# Altium project Hardware2_Smartwatch.PrjPcb (part 2 of 3)

## Sheet 6_Airframe-NXP_i.MX7.SchDoc
size A2; SheetNumber: 6; SheetTotal: 9
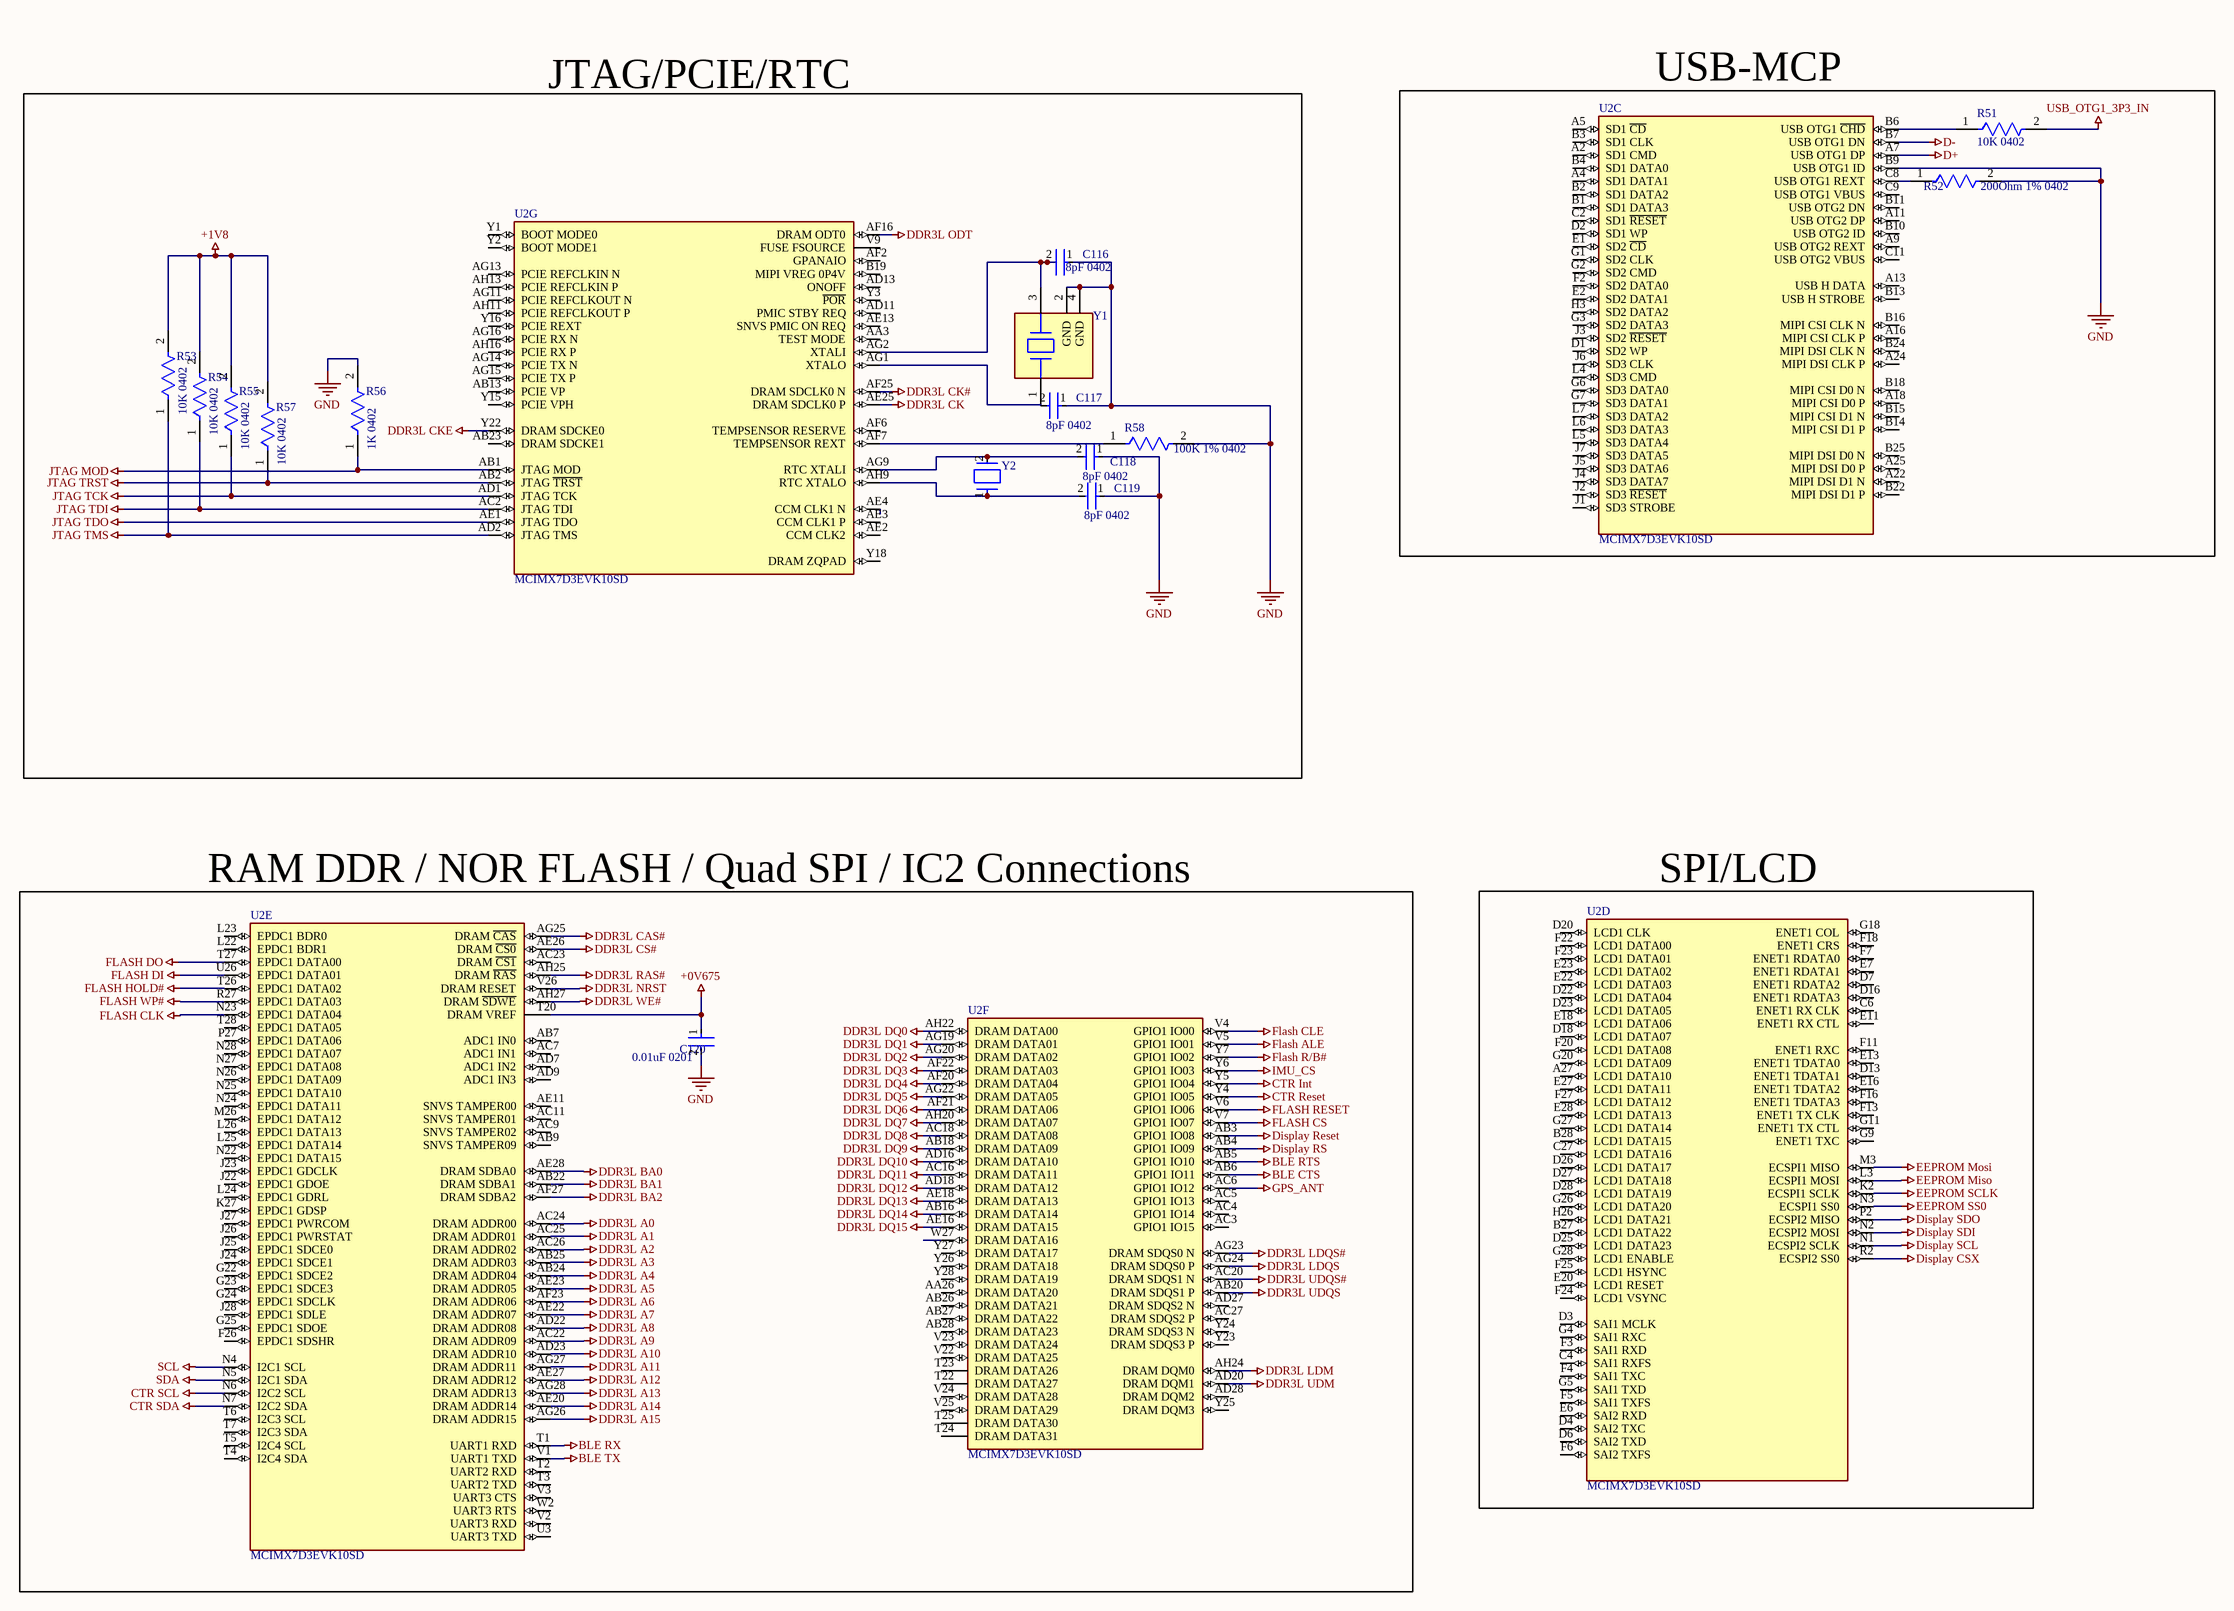
[diagram p6: 6_Airframe-NXP_i.MX7.SchDoc]

### Parts
C116  8pF 0402  [FP-C0402C225M9PACTU-MFG]
C117  8pF 0402  [FP-C0402C225M9PACTU-MFG]
C118  8pF 0402  [FP-C0402C225M9PACTU-MFG]
C119  8pF 0402  [FP-C0402C225M9PACTU-MFG]
C120  0.01uF 0201  [FP-C0603-030-0_03-IPC_C]
R51  10K 0402  [FP-CRCW0402-e3-IPC_B]
R52  200Ohm 1% 0402  [FP-CRCW0402-e3-IPC_C]
R53  10K 0402  [FP-CRCW0402-e3-IPC_B]
R54  10K 0402  [FP-CRCW0402-e3-IPC_B]
R55  10K 0402  [FP-CRCW0402-e3-IPC_B]
R56  1K 0402  [FP-CRCW0402-e3-IPC_B]
R57  10K 0402  [FP-CRCW0402-e3-IPC_B]
R58  100K 1% 0402  [FP-CRCW0402-e3-IPC_C]
U2  MCIMX7D3EVK10SD  [FP-SOT1839-1-IPC_C]  (parts C,D,E,F,G of 9)
Y1  ABM8AIG-24.000MHZ-12-2Z-T3  [FP-ABM8AIG-MFG]  (value not drawn)
Y2  ABS06-32.768KHZ-9-T  [FP-ABS06-MFG]  (value not drawn)

### Nets
+0V675: C120.1 U2.T20(DRAM_VREF)
+1V8: R53.2 R54.2 R55.2 R57.2
BLE CTS: U2.AB6(GPIO1_IO11)
BLE RTS: U2.AB5(GPIO1_IO10)
BLE RX: U2.T1(UART1_RXD)
BLE TX: U2.V1(UART1_TXD)
CTR Int: U2.Y5(GPIO1_IO04)
CTR Reset: U2.Y4(GPIO1_IO05)
CTR SCL: U2.N6(I2C2_SCL)
CTR SDA: U2.N7(I2C2_SDA)
D+: U2.A7(USB_OTG1_DP)
D-: U2.B7(USB_OTG1_DN)
DDR3L A0: U2.AC24(DRAM_ADDR00)
DDR3L A1: U2.AC25(DRAM_ADDR01)
DDR3L A2: U2.AC26(DRAM_ADDR02)
DDR3L A3: U2.AB25(DRAM_ADDR03)
DDR3L A4: U2.AB24(DRAM_ADDR04)
DDR3L A5: U2.AE23(DRAM_ADDR05)
DDR3L A6: U2.AF23(DRAM_ADDR06)
DDR3L A7: U2.AE22(DRAM_ADDR07)
DDR3L A8: U2.AD22(DRAM_ADDR08)
DDR3L A9: U2.AC22(DRAM_ADDR09)
DDR3L A10: U2.AD23(DRAM_ADDR10)
DDR3L A11: U2.AG27(DRAM_ADDR11)
DDR3L A12: U2.AE27(DRAM_ADDR12)
DDR3L A13: U2.AG28(DRAM_ADDR13)
DDR3L A14: U2.AE20(DRAM_ADDR14)
DDR3L A15: U2.AG26(DRAM_ADDR15)
DDR3L BA0: U2.AE28(DRAM_SDBA0)
DDR3L BA1: U2.AB22(DRAM_SDBA1)
DDR3L BA2: U2.AF27(DRAM_SDBA2)
DDR3L CAS#: U2.AG25(DRAM_~{CAS})
DDR3L CK: U2.AE25(DRAM_SDCLK0_P)
DDR3L CK#: U2.AF25(DRAM_SDCLK0_N)
DDR3L CKE: U2.Y22(DRAM_SDCKE0)
DDR3L CS#: U2.AE26(DRAM_~{CS0})
DDR3L DQ0: U2.AH22(DRAM_DATA00)
DDR3L DQ1: U2.AG19(DRAM_DATA01)
DDR3L DQ2: U2.AG20(DRAM_DATA02)
DDR3L DQ3: U2.AF22(DRAM_DATA03)
DDR3L DQ4: U2.AF20(DRAM_DATA04)
DDR3L DQ5: U2.AG22(DRAM_DATA05)
DDR3L DQ6: U2.AF21(DRAM_DATA06)
DDR3L DQ7: U2.AH20(DRAM_DATA07)
DDR3L DQ8: U2.AC18(DRAM_DATA08)
DDR3L DQ9: U2.AB18(DRAM_DATA09)
DDR3L DQ10: U2.AD16(DRAM_DATA10)
DDR3L DQ11: U2.AC16(DRAM_DATA11)
DDR3L DQ12: U2.AD18(DRAM_DATA12)
DDR3L DQ13: U2.AE18(DRAM_DATA13)
DDR3L DQ14: U2.AB16(DRAM_DATA14)
DDR3L DQ15: U2.AE16(DRAM_DATA15)
DDR3L LDM: U2.AH24(DRAM_DQM0)
DDR3L LDQS: U2.AG24(DRAM_SDQS0_P)
DDR3L LDQS#: U2.AG23(DRAM_SDQS0_N)
DDR3L NRST: U2.V26(DRAM_RESET)
DDR3L ODT: U2.AF16(DRAM_ODT0)
DDR3L RAS#: U2.AH25(DRAM_~{RAS})
DDR3L UDM: U2.AD20(DRAM_DQM1)
DDR3L UDQS: U2.AB20(DRAM_SDQS1_P)
DDR3L UDQS#: U2.AC20(DRAM_SDQS1_N)
DDR3L WE#: U2.AH27(DRAM_~{SDWE})
Display CSX: U2.R2(ECSPI2_SS0)
Display Reset: U2.AB3(GPIO1_IO08)
Display RS: U2.AB4(GPIO1_IO09)
Display SCL: U2.N1(ECSPI2_SCLK)
Display SDI: U2.N2(ECSPI2_MOSI)
Display SDO: U2.P2(ECSPI2_MISO)
EEPROM Miso: U2.L3(ECSPI1_MOSI)
EEPROM Mosi: U2.M3(ECSPI1_MISO)
EEPROM SCLK: U2.K2(ECSPI1_SCLK)
EEPROM SS0: U2.N3(ECSPI1_SS0)
Flash ALE: U2.V5(GPIO1_IO01)
Flash CLE: U2.V4(GPIO1_IO00)
FLASH CLK: U2.N23(EPDC1_DATA04)
FLASH CS: U2.V7(GPIO1_IO07)
FLASH DI: U2.U26(EPDC1_DATA01)
FLASH DO: U2.T27(EPDC1_DATA00)
FLASH HOLD#: U2.T26(EPDC1_DATA02)
Flash R/B#: U2.Y7(GPIO1_IO02)
FLASH RESET: U2.V6(GPIO1_IO06)
FLASH WP#: U2.R27(EPDC1_DATA03)
GND: C116.1 C117.1 C118.1 C119.1 C120.2 R52.2 R56.2 R58.2 U2.B9(USB_OTG1_ID) Y1.2(GND) Y1.4(GND)  [project net CTR]
GPS_ANT: U2.AC6(GPIO1_IO12)
IMU_CS: U2.Y6(GPIO1_IO03)
JTAG MOD: R56.1 U2.AB1(JTAG_MOD)
JTAG TCK: R55.1 U2.AD1(JTAG_TCK)
JTAG TDI: R54.1 U2.AC2(JTAG_TDI)
JTAG TDO: U2.AE1(JTAG_TDO)
JTAG TMS: R53.1 U2.AD2(JTAG_TMS)
JTAG TRST: R57.1 U2.AB2(JTAG_~{TRST})
SCL: U2.N4(I2C1_SCL)
SDA: U2.N5(I2C1_SDA)
USB_OTG1_3P3_IN: R51.2  [project net +VS]
NetC116_2: C116.2 U2.AG2(XTALI) Y1.3
NetC118_2: C118.2 U2.AG9(RTC_XTALI) Y2.2
NetC119_2: C119.2 U2.AH9(RTC_XTALO) Y2.1
NetR51_1: R51.1 U2.B6(USB_OTG1_~{CHD})
NetR52_1: R52.1 U2.C8(USB_OTG1_REXT)
NetR58_1: R58.1 U2.AF7(TEMPSENSOR_REXT)
NetU2_AG1: U2.AG1(XTALO) Y1.1

Not connected (* = marked no-connect by the designer): C117 2; U2 A2(SD1_CMD) A4(SD1_DATA1) A5(SD1_~{CD}) A9(USB_OTG2_REXT) A11(USB_OTG2_DP) A13(USB_H_DATA) A16(MIPI_CSI_CLK_P) A18(MIPI_CSI_D0_P) A22(MIPI_DSI_D1_N) A24(MIPI_DSI_CLK_P) A25(MIPI_DSI_D0_P) A27(LCD1_DATA10) AA3(TEST_MODE) AA26(DRAM_DATA20) AB7(ADC1_IN0) AB9(SNVS_TAMPER09) AB13(PCIE_VP) AB23(DRAM_SDCKE1) AB26(DRAM_DATA21) AB27(DRAM_DATA22) AB28(DRAM_DATA23) AC3(GPIO1_IO15) AC4(GPIO1_IO14) AC5(GPIO1_IO13) AC7(ADC1_IN1) AC9(SNVS_TAMPER02) AC11(SNVS_TAMPER01) AC23(DRAM_~{CS1}) AC27(DRAM_SDQS2_P) AD7(ADC1_IN2) AD9(ADC1_IN3) AD11(PMIC_STBY_REQ) AD13(ONOFF) AD27(DRAM_SDQS2_N) AD28(DRAM_DQM2) AE2(CCM_CLK2) AE3(CCM_CLK1_P) AE4(CCM_CLK1_N) AE11(SNVS_TAMPER00) AE13(SNVS_PMIC_ON_REQ) AF2(GPANAIO) AF6(TEMPSENSOR_RESERVE) AG11(PCIE_REFCLKOUT_N) AG13(PCIE_REFCLKIN_N) AG14(PCIE_TX_N) AG15(PCIE_TX_P) AG16(PCIE_RX_N) AH11(PCIE_REFCLKOUT_P) AH13(PCIE_REFCLKIN_P) AH16(PCIE_RX_P) B1(SD1_DATA3) B2(SD1_DATA2) B3(SD1_CLK) B4(SD1_DATA0) B10(USB_OTG2_ID) B11(USB_OTG2_DN) B13(USB_H_STROBE) B14(MIPI_CSI_D1_P) B15(MIPI_CSI_D1_N) B16(MIPI_CSI_CLK_N) B18(MIPI_CSI_D0_N) B19(MIPI_VREG_0P4V) B22(MIPI_DSI_D1_P) B24(MIPI_DSI_CLK_N) B25(MIPI_DSI_D0_N) B27(LCD1_DATA22) B28(LCD1_DATA15) C2(SD1_~{RESET}) C4(SAI1_RXFS) C6(ENET1_RX_CLK) C9(USB_OTG1_VBUS) C11(USB_OTG2_VBUS) C27(LCD1_DATA16) D1(SD2_WP) D2(SD1_WP) D3(SAI1_MCLK) D4(SAI2_TXC) D6(SAI2_TXD) D7(ENET1_RDATA2) D13(ENET1_TDATA1) D16(ENET1_RDATA3) D18(LCD1_DATA07) D20(LCD1_CLK) D22(LCD1_DATA04) D23(LCD1_DATA05) D25(LCD1_DATA23) D26(LCD1_DATA17) D27(LCD1_DATA18) D28(LCD1_DATA19) E1(SD2_~{CD}) E2(SD2_DATA1) E6(SAI2_RXD) E7(ENET1_RDATA1) E11(ENET1_RX_CTL) E13(ENET1_TDATA0) E16(ENET1_TDATA2) E18(LCD1_DATA06) E20(LCD1_RESET) E22(LCD1_DATA03) E23(LCD1_DATA02) E27(LCD1_DATA11) E28(LCD1_DATA13) F2(SD2_DATA0) F3(SAI1_RXD) F4(SAI1_TXC) F5(SAI1_TXFS) F6(SAI2_TXFS) F7(ENET1_RDATA0) F11(ENET1_RXC) F13(ENET1_TX_CLK) F16(ENET1_TDATA3) F18(ENET1_CRS) F20(LCD1_DATA08) F22(LCD1_DATA00) F23(LCD1_DATA01) F24(LCD1_VSYNC) F25(LCD1_HSYNC) F26(EPDC1_SDSHR) F27(LCD1_DATA12) G1(SD2_CLK) G2(SD2_CMD) G3(SD2_DATA3) G4(SAI1_RXC) G5(SAI1_TXD) G6(SD3_DATA0) G7(SD3_DATA1) G9(ENET1_TXC) G11(ENET1_TX_CTL) G18(ENET1_COL) G20(LCD1_DATA09) G22(EPDC1_SDCE2) G23(EPDC1_SDCE3) G24(EPDC1_SDCLK) G25(EPDC1_SDOE) G26(LCD1_DATA20) G27(LCD1_DATA14) G28(LCD1_ENABLE) H3(SD2_DATA2) H26(LCD1_DATA21) J1(SD3_STROBE) J2(SD3_~{RESET}) J3(SD2_~{RESET}) J4(SD3_DATA7) J5(SD3_DATA6) J6(SD3_CLK) J7(SD3_DATA5) J22(EPDC1_GDOE) J23(EPDC1_GDCLK) J24(EPDC1_SDCE1) J25(EPDC1_SDCE0) J26(EPDC1_PWRSTAT) J27(EPDC1_PWRCOM) J28(EPDC1_SDLE) K27(EPDC1_GDSP) L4(SD3_CMD) L5(SD3_DATA4) L6(SD3_DATA3) L7(SD3_DATA2) L22(EPDC1_BDR1) L23(EPDC1_BDR0) L24(EPDC1_GDRL) L25(EPDC1_DATA14) L26(EPDC1_DATA13) M26(EPDC1_DATA12) N22(EPDC1_DATA15) N24(EPDC1_DATA11) N25(EPDC1_DATA10) N26(EPDC1_DATA09) N27(EPDC1_DATA08) N28(EPDC1_DATA07) P27(EPDC1_DATA06) T2(UART2_RXD) T3(UART2_TXD) T4(I2C4_SDA) T5(I2C4_SCL) T6(I2C3_SCL) T7(I2C3_SDA) T22(DRAM_DATA27) T23(DRAM_DATA26) T24(DRAM_DATA31) T25(DRAM_DATA30) T28(EPDC1_DATA05) U3(UART3_TXD) V2(UART3_RXD) V3(UART3_CTS) V9(FUSE_FSOURCE) V22(DRAM_DATA25) V23(DRAM_DATA24) V24(DRAM_DATA28) V25(DRAM_DATA29) W2(UART3_RTS) W27(DRAM_DATA16) Y1(BOOT_MODE0) Y2(BOOT_MODE1) Y3(~{POR}) Y15(PCIE_VPH) Y16(PCIE_REXT) Y18(DRAM_ZQPAD) Y23(DRAM_SDQS3_P) Y24(DRAM_SDQS3_N) Y25(DRAM_DQM3) Y26(DRAM_DATA18) Y27(DRAM_DATA17) Y28(DRAM_DATA19)

### Notes on the sheet
- JTAG/PCIE/RTC
- (near U2) USB-MCP
- (near U2) RAM DDR / NOR FLASH / Quad SPI / IC2 Connections
- (near U2) SPI/LCD

### Library data of the parts
C116-C119 = CMP-2008-02064-3: CAP CER 2.2UF 6.3V X5R 0402; Tolerance: 20%; Dissipation Factor: 5%; Dielectric Material: Ceramic; Lead Free: Lead Free; Depth: 0.5mm; Series: C; Termination: SMD/SMT; Case Code (Metric): 1005; Case/Package: 0402; Dielectric: X5R; RoHS Compliant: Yes; Thickness: 0.022inch; Voltage Rating: 6.3V; Voltage: 6.3V; Height: 0.5mm; Mount: Surface Mount; Construction: Flat; Case Code (Imperial): 0402; Min Operating Temperature: -55°C; Contact Plating: Tin; Radiation Hardening: No; Number of Pins: 2; Voltage Rating (DC): 6.3V; Capacitance: 2.2uF; Width: 0.5mm; Package Quantity: 1; Packaging: Tape and Reel; Max Operating Temperature: 85°C; Length: 1mm; REACH SVHC: No SVHC
C120 = CMP-08246-007095-1: Multilayer Ceramic Capacitors 220nF ±10% 6.3V X6S SMD 0201; Dielectric: X6S; Resistor Type: Ceramic; Length: 0.6mm; Capacitance: 220nF; Case Code (Metric): 0603; Series: C; Width: 0.012inch; Height: 0.3mm; Voltage Rating: 6.3V; Max Operating Temperature: 105°C; REACH SVHC: No SVHC; RoHS Compliant: Yes; Tolerance: 10%; Termination: SMD/SMT; Case/Package: 0201; Case Code (Imperial): 0201; Weight: 6E-06oz; Lead Free: Lead Free; Construction: Flat; Thickness: 300um; Mount: Surface Mount; Dielectric Material: Ceramic; Voltage Rating (DC): 6.3V; Packaging: Cut Tape; Package Quantity: 1; Min Operating Temperature: -55°C; Depth: 0.3mm
R51 R53-R57 = CMP-2002-08135-2: RES SMD 10K OHM 1% 1/16W 0402; Power Rating: 63mW; Resistance: 10kR; Voltage Rating: 50V; Temperature Coefficient: 100ppm/°C; Case Code (Metric): 1005; Features: Automotive AEC-Q200; Termination: SMD/SMT; Mount: Surface Mount; Package Quantity: 10; Packaging: Tape and Reel; Case Code (Imperial): 0402; Weight: 2.3E-05oz; Lead Free: Lead Free; Width: 0.02inch; Max Power Dissipation: 63mW; Tolerance: 1%; Number of Terminations: 2; Height: 0.35mm; Number of Pins: 2; Composition: Thick Film; Length: 1mm; Voltage Rating (DC): 50V; Case/Package: 0402; Radiation Hardening: No; Contact Plating: Tin; Depth: 0.5mm; Military Standard: Not; Min Operating Temperature: -55°C; Max Operating Temperature: 155°C
R52 R58 = CMP-1011-00429-3: RES Thick Film, 200Ω, 1%, 0.063W, 100ppm/°C, 0402; Max Power Dissipation: 63mW; Voltage Rating: 50V; Resistance: 200R; Termination: SMD/SMT; Weight: 2.3E-05oz; Case/Package: 0402; Contact Plating: Tin; Number of Pins: 2; Width: 0.5mm; Height: 0.35mm; Case Code (Metric): 1005; Military Standard: Not; Features: Automotive AEC-Q200; Power Rating: 63mW; Temperature Coefficient: 100ppm/°C; Tolerance: 1%; Lead Free: Lead Free; Depth: 0.5mm; Max Operating Temperature: 155°C; Min Operating Temperature: -55°C; Package Quantity: 10; Voltage Rating (DC): 50V; Composition: Thick Film; Mount: Surface Mount; Radiation Hardening: No; Length: 1mm; Packaging: Tape and Reel; Number of Terminations: 2; Case Code (Imperial): 0402
U2 = CMP-10096-000008-1: I.MX 7DUAL: REV 1.3; Manufacturer: NXP; Number Of I2C Channels: 4; Number Of Timers/Counters: 11; Nominal Supply Current: 1-1000mA; Max Junction Temp: +105°C; Number Of Uart Channels: 7; Number Of Cores: 2; Interface: I2C,SPI,UART,USB,Ethernet,I2S,LVDS,PCIe,Other; Ram Size: 256KBytes; Data Bus Width: 32bits; Number Of Usb Channels: 3; Number Of Adc Channels: 1; Standoff Height: 0.13mm; Frequency: 1GHz; Max Supply Voltage: 3.6V; Core Architecture: Arm Cortex-A7; Number Of Spi Channels: 5; Memory Type: FLASH,NAND,DDR2,DDR3,OTHER; Min Supply Voltage: 0.95V; ComponentLink2URL: https://www.nxp.com/docs/en/data-sheet/IMX7DCEC.pdf; Number Of Pwm Channels: 4; Package: SOT1839-1; Temperature: -20°C to +105°C; Footprint Url: https://www.nxp.com/docs/en/package-information/98ASA00727D.pdf; RoHS: TRUE; Temperature Range Low: -20°C; Lead Free: Yes; Category: IC; Ipc Land Pattern Name: BGA784N40P28X28_1200X1200X110; Device Class L3: Microprocessors; Mouser Description: i.MX 7Dual: 2x Cortex A7, 2x USB 2.0 OTG with PHY, PCIe, 2xSDIO/MMC, 2x Ethernet, Security; ComponentLink2Description: Datasheet; Manufacturer Part Number: MCIMX7D3EVK10SD; Octopart: https://octopart.com/mcimx7d3evk10sd-nxp+semiconductors-84356608; Digikey Description: I.MX 7DUAL: REV 1.3; Device Class L1: Integrated Circuits (ICs); Temperature Range High: +105°C; Height: 1.1mm; Automotive: No; Number Of Ethernet Channels: 2; Number Of A/D Converters: 1; Device Class L2: Embedded Processors and Controllers
Y1 = CMP-27762-015716-1: Crystal 24MHz ±20ppm (Tol) ±50ppm (Stability) 12pF FUND 50Ω Automotive 4-Pin Ultra Mini-CSMD T/R; ESR (Equivalent Series Resistance): 50R; Series: ABM8AIG; RoHS Compliant: Yes; Load Capacitance: 12pF; Height: 0.031inch; Min Operating Temperature: -40°C; Mount: Surface Mount; Packaging: Cut Tape; Ratings: AEC-Q200; Case/Package: SMD/SMT; Frequency Stability: 50ppm; Max Operating Temperature: 125°C; Length: 0.126inch; Frequency: 24MHz; Frequency Tolerance: 20ppm; Width: 0.098inch
Y2 = CMP-27762-015421-1: Crystal 32.768kHz ±20ppm (Tol) 9pF FUND 90kΩ 2-Pin Mini-CSMD T/R; ESR (Equivalent Series Resistance): 90kR; Max Operating Temperature: 85°C; Frequency Tolerance: 20ppm; Case/Package: CSMD; Termination: SMD/SMT; RoHS Compliant: Yes; Height: 0.6mm; Load Capacitance: 9pF; Packaging: Tape and Reel; Depth: 1.2mm; Tolerance: 20ppm; Frequency: 32.768kHz; Series: ABS06; Width: 1.2mm; Length: 2mm; Number of Pins: 2; Min Operating Temperature: -40°C; Mount: Surface Mount; Lead Free: Lead Free; Package Quantity: 3000

## Sheet 7_Airframe-Sensors.SchDoc
size A4; SheetNumber: 7; SheetTotal: 9
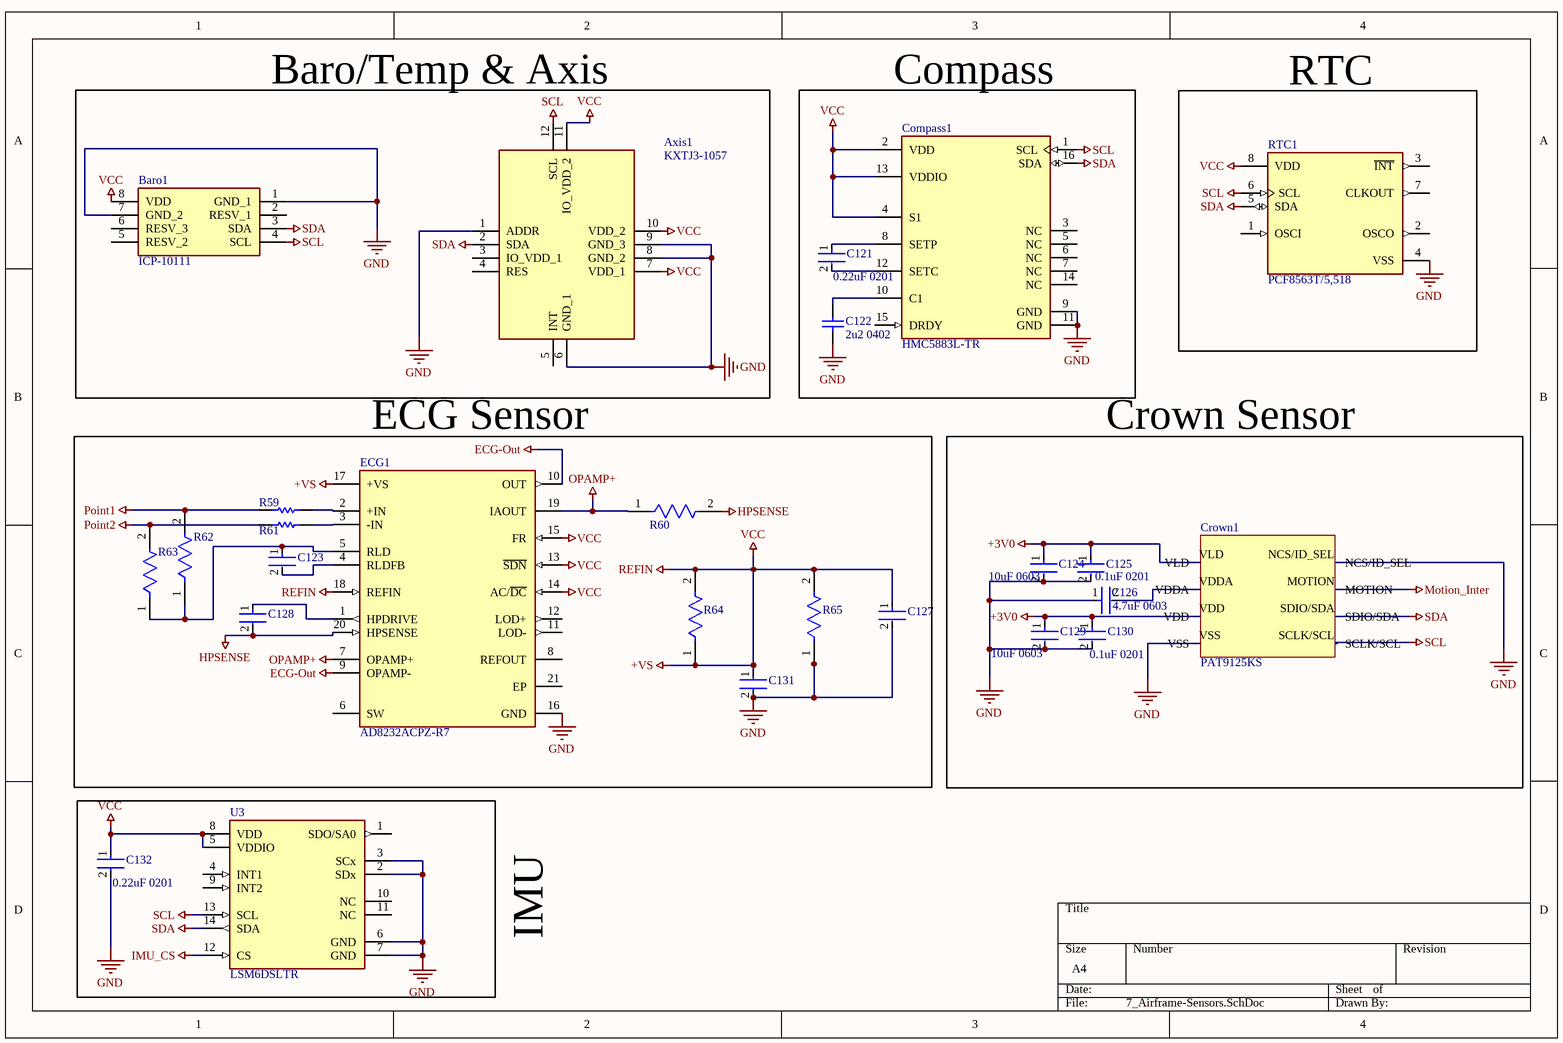
[diagram p7: 7_Airframe-Sensors.SchDoc]

### Parts
Axis1  KXTJ3-1057  [2X2X0.9MMLGA]
Baro1  ICP-10111  [ICP10111]
C121  0.22uF 0201  [FP-C0603-030-0_03-IPC_C]
C122  2u2 0402  [CAPC1005X55X25ML5T10]
C123  GRM1555C1H102JA01D  [FP-GRM155-0_05-IPC_B]  (value not drawn)
C124  10uF 0603  [FP-GRM188-0_2-IPC_C]
C125  0.1uF 0201  [FP-C0603-030-0_03-IPC_C]
C126  4.7uF 0603  [FP-GRM188-0_2-IPC_C]
C127  C0402C104K8PACTU  [FP-C0402-BB-MFG]  (value not drawn)
C128  GRM155R71C224KA12D  [FP-GRM155-0_05-IPC_C]  (value not drawn)
C129  10uF 0603  [FP-GRM188-0_2-IPC_C]
C130  0.1uF 0201  [FP-C0603-030-0_03-IPC_C]
C131  C0402C104K8PACTU  [FP-C0402-BB-MFG]  (value not drawn)
C132  0.22uF 0201  [FP-C0603-030-0_03-IPC_C]
Compass1  HMC5883L-TR  [FP-HMC5883L-TR-MFG]
Crown1  PAT9125KS  [PAT9125KS-Footprint-1]
ECG1  AD8232ACPZ-R7  [FP-CP-20-8-IPC_C]
R59  RC0402FR-07180KL  [RESC1005X40X25ML05T10]  (value not drawn)
R60  CR0402-JW-105GLF  [FP-CR0402-MFG]  (value not drawn)
R61  RC0402FR-07180KL  [RESC1005X40X25ML05T10]  (value not drawn)
R62  CR0402-JW-105GLF  [FP-CR0402-MFG]  (value not drawn)
R63  CR0402-JW-105GLF  [FP-CR0402-MFG]  (value not drawn)
R64  CR0402-JW-105GLF  [FP-CR0402-MFG]  (value not drawn)
R65  CR0402-JW-105GLF  [FP-CR0402-MFG]  (value not drawn)
RTC1  PCF8563T/5,518  [FP-SOT96-1-MFG]
U3  LSM6DSLTR  [FP-LGA-14L-DM00249496-MFG]

### Nets
+3V0: C124.1 C125.1 C129.1 C130.1 Crown1.VDD Crown1.VLD
+VS: Axis1.7(VDD_1) Axis1.10(VDD_2) Axis1.11(IO_VDD_2) Baro1.8(VDD) C127.1 C131.1 C132.1 Compass1.2(VDD) Compass1.4(S1) Compass1.13(VDDIO) ECG1.13(~{SDN}) ECG1.14(AC/~{DC}) ECG1.15(FR) ECG1.17(+VS) ECG1.18(REFIN) R64.1 R64.2 R65.2 RTC1.8(VDD) U3.5(VDDIO) U3.8(VDD)  [also labelled REFIN, VCC]
ECG-Out: ECG1.9(OPAMP-) ECG1.10(OUT)
GND: Axis1.1(ADDR) Axis1.6(GND_1) Axis1.8(GND_2) Axis1.9(GND_3) Baro1.1(GND_1) Baro1.7(GND_2) C122.2 C124.2 C125.2 C126.1 C127.2 C129.2 C130.2 C131.2 C132.2 Compass1.9(GND) Compass1.11(GND) Crown1.NCS/ID_SEL Crown1.VSS ECG1.16(GND) R65.1 RTC1.4(VSS) U3.2(SDx) U3.3(SCx) U3.6(GND) U3.7(GND)  [project net CTR]
HPSENSE: C128.2 ECG1.20(HPSENSE) R60.2
IMU_CS: U3.12(CS)
Motion_Inter: Crown1.MOTION
OPAMP+: ECG1.7(OPAMP+) ECG1.19(IAOUT) R60.1
Point1: R59.1 R62.2
Point2: R61.1 R63.2
SCL: Axis1.12(SCL) Baro1.4(SCL) Compass1.1(SCL) Crown1.SCLK/SCL RTC1.6(SCL) U3.13(SCL)
SDA: Axis1.2(SDA) Baro1.3(SDA) Compass1.16(SDA) Crown1.SDIO/SDA RTC1.5(SDA) U3.14(SDA)
NetC121_1: C121.1 Compass1.8(SETP)
NetC121_2: C121.2 Compass1.12(SETC)
NetC122_1: C122.1 Compass1.10(C1)
NetC123_1: C123.1 ECG1.5(RLD) R62.1 R63.1
NetC123_2: C123.2 ECG1.4(RLDFB)
NetC126_2: C126.2 Crown1.VDDA
NetC128_1: C128.1 ECG1.1(HPDRIVE)
NetECG1_2: ECG1.2(+IN) R59.2
NetECG1_3: ECG1.3(-IN) R61.2

Not connected (* = marked no-connect by the designer): Axis1 3(IO_VDD_1) 4(RES) 5(INT); Baro1 2(RESV_1) 5(RESV_2) 6(RESV_3); Compass1 3(NC) 5(NC) 6(NC) 7(NC) 14(NC) 15(DRDY); ECG1 6(SW) 8(REFOUT) 11(LOD-) 12(LOD+) 21(EP); RTC1 1(OSCI) 2(OSCO) 3(~{INT}) 7(CLKOUT); U3 1(SDO/SA0) 4(INT1) 9(INT2) 10(NC) 11(NC)

### Notes on the sheet
- Baro/Temp & Axis
- Compass
- RTC
- ECG Sensor
- Crown Sensor
- IMU

### Library data of the parts
Axis1 = KXTJ3-1057: Accelerometer; Manufacturer_Name: Kionix; Datasheet Link: http://www.mouser.com/ds/2/348/KXTJ3-1057 Specifications Rev 2.0-1074602.pdf; Manufacturer_Part_Number: KXTJ3-1057; Mouser Part Number: 912-KXTJ3-1057; Mouser Price/Stock: https://www.mouser.co.uk/ProductDetail/Kionix/KXTJ3-1057?qs=hicmRmzGcNR8WipH%252BLEjqg%3D%3D
Baro1 = ICP-10111: Undefined or Miscellaneous; Manufacturer_Name: TDK; Datasheet Link: https://product.tdk.com/system/files/dam/doc/product/sensor/pressure/capacitive-pressure/data_sheet/ds-000186-icp-101xx.pdf; Height: 1mm; Manufacturer_Part_Number: ICP-10111; Mouser Part Number: 410-ICP-10111; Mouser Price/Stock: https://www.mouser.co.uk/ProductDetail/TDK-InvenSense/ICP-10111?qs=%252BEew9%252B0nqrBWGDChI3rokg%3D%3D; Arrow Part Number: ICP-10111; Arrow Price/Stock: https://www.arrow.com/en/products/icp-10111/invensense
C121 C125 C130 C132 = CMP-08246-007095-1: as C120 on sheet 6_Airframe-NXP_i.MX7; Dielectric: X6S; Resistor Type: Ceramic; Length: 0.6mm; Capacitance: 220nF; Case Code (Metric): 0603; Series: C; Width: 0.012inch; Height: 0.3mm; Voltage Rating: 6.3V; Max Operating Temperature: 105°C; REACH SVHC: No SVHC; RoHS Compliant: Yes; Tolerance: 10%; Termination: SMD/SMT; Case/Package: 0201; Case Code (Imperial): 0201; Weight: 6E-06oz; Lead Free: Lead Free; Construction: Flat; Thickness: 300um; Mount: Surface Mount; Dielectric Material: Ceramic; Voltage Rating (DC): 6.3V; Packaging: Cut Tape; Package Quantity: 1; Min Operating Temperature: -55°C; Depth: 0.3mm
C122 = CMP-1662-00017-1: Chip Capacitor, 1 nF, +/- 10%, 50 V, -55 to 125 degC, 0402 (1005 Metric), RoHS, Tape and Reel; Case\/Package: 0402; Type (Capacitors): X7R; Voltage Rating (DC): 50 V; Capacitance: 1 nF; Width: 0.5 mm; Pins: 2; REACH SVHC: No SVHC; Length: 1 mm; Height: 0.5 mm; PackageDescription: 2-Pin Surface Mount Device, Body 1 x 0.5 mm; DatasheetVersion: 07/2016; Mount: Surface Mount; ComponentLink2Description: Datasheet; Tolerance: 10%; ComponentLink2URL: http://psearch.en.murata.com/capacitor/product/GRM155R71H102KA01%23.pdf; ComponentLink1URL: http://www.murata.com/; Case Code (Metric): 1005; Package Quantity: 10000; Min Operating Temperature: -55 degC; Max Operating Temperature: 125 degC; Voltage Rating: 50 V; ComponentLink1Description: Manufacturer URL; Packaging: Tape and Reel; Radiation Hardening: No; RoHSCompliant: true; PackageReference: 0402; Mounting Technology: Surface Mount; Case Code (Imperial): 0402
C123 = CMP-2008-04254-2: Chip Multilayer Ceramic Capacitors for General Purpose, 0402, 1000pF, C0G, 30ppm/°C, 5%, 50V; Insulation Resistance: 10GR; Capacitance: 1nF; Packaging: Tape and Reel; Lead Free: Lead Free; Tolerance: 5%; Temperature Coefficient: 30ppm/°C; Thickness: 0.022inch; Termination: SMD/SMT; Max Operating Temperature: 125°C; Height: 0.5mm; Package Quantity: 1; Radiation Hardening: No; Material: Ceramic; Case Code (Metric): 1005; Number of Pins: 2; Voltage Rating: 50V; Mount: Surface Mount; Voltage: 50V; Case/Package: 0402; Min Operating Temperature: -55°C; Dielectric Material: Ceramic; Width: 0.5mm; Depth: 0.5mm; Case Code (Imperial): 0402; REACH SVHC: No SVHC; Dielectric: C0G; Voltage Rating (DC): 50V; Length: 1mm
C124 C126 C129 = CMP-2000-06337-3: Chip Multilayer Ceramic Capacitors for General Purpose, 0603, 22uF, X5R, 15%, 20%, 10V; Tolerance: 20%; Weight: 0.000222oz; Material: Ceramic; Depth: 0.8mm; Length: 1.6mm; Termination: SMD/SMT; Capacitance: 22uF; Packaging: Tape and Reel; Width: 0.8mm; Voltage Rating: 10V; Case Code (Imperial): 0603; Mount: Surface Mount; Voltage Rating (DC): 10V; Case/Package: 0603; Thickness: 0.039inch; REACH SVHC: No SVHC; Dielectric: X5R; Height: 0.8mm; Package Quantity: 4000; Case Code (Metric): 1608; Min Operating Temperature: -55°C; Lead Free: Lead Free; Max Operating Temperature: 85°C
C127 C131 = CMP-2008-02046-2: CAP CER 0.1UF 10V X5R 0402; Manufacturer: Kemet; Material: Ceramic; Capacitance: 0.10 μF; Temperature Coefficient: 15%; Tolerance: 0.1; Value: 0.10 μF; Package: C0402-BB; Temperature: -55°C to +125°C; ComponentLink2Description: Datasheet; Temperature Characteristic: X5R; Device Class L1: Passive Components; Height: 0.55mm; Lead Free: Yes; ComponentLink2URL: https://content.kemet.com/datasheets/KEM_C1002_X7R_SMD.pdf; Device Class L2: Capacitors; Temperature Range Low: -55°C; Temperature Range High: +125°C; RoHS: TRUE; Octopart: https://octopart.com/c0402c104k8pactu-kemet-140039; Automotive: No; Mouser Description: Capacitor 100 nF 10 VDC 0402; Category: Cap; Voltage Rating: 10 V; Digikey Description: CAP CER 0.1UF 10V X5R 0402; Ipc Land Pattern Name: CAPC10050X50; Device Class L3: Ceramic Capacitors; Manufacturer Part Number: C0402C104K8PACTU
C128 = CMP-1034-02089-3: Chip Multilayer Ceramic Capacitors for General Purpose, 0402, 0.22uF, X7R, 15%, 10%, 16V; Capacitance: 220nF; Depth: 0.5mm; Dielectric: X7R; Min Operating Temperature: -55°C; Package Quantity: 1; Termination: SMD/SMT; Mount: Surface Mount; Radiation Hardening: No; Height: 0.5mm; Case Code (Metric): 1005; Packaging: Tape and Reel; Material: Ceramic; Voltage: 16V; Voltage Rating (DC): 16V; REACH SVHC: No SVHC; Voltage Rating: 16V; Length: 1mm; Tolerance: 10%; Thickness: 0.022inch; Case Code (Imperial): 0402; Max Operating Temperature: 125°C; Width: 0.02inch; Lead Free: Lead Free; Case/Package: 0402
Compass1 = CMP-2000-05148-2: SENSOR MR I2C 16LCC; Min Supply Voltage: 2.16V; Operating Supply Current: 100uA; Max Supply Voltage: 3.6V; Operating Supply Voltage: 2.5V; Min Operating Temperature: -30°C; Interface: I2C; Max Operating Temperature: 85°C; Package Quantity: 4000; REACH SVHC: No SVHC; Case/Package: LCC; Packaging: Tape and Reel; Number of Pins: 16; Radiation Hardening: No
Crown1 = CMP-00000-2
ECG1 = CMP-09085-000003-1: IC ECG FRONT END 20LFCSP; Input Offset Voltage (Vos): 3mV; Power Supply Rejection Ratio (PSRR): 90dB; Input Bias Current: 50pA; Nominal Supply Current: 170uA; Min Supply Voltage: 2V; Common Mode Rejection Ratio: 80dB; Max Supply Voltage: 3.5V; Contact Plating: Tin; Operating Supply Current: 170uA; Packaging: Tape and Reel; REACH SVHC: No SVHC; Case/Package: LFCSP EP; Number of Pins: 20; Lead Free: Contains Lead; Min Operating Temperature: -40°C; Package Quantity: 1500; Mount: Surface Mount; Max Operating Temperature: 85°C
R59 R61 = CMP-1011-00763-4: Chip Resistor, 180 KOhm, +/- 1%, 62.5 mW, -55 to 155 degC, 0402 (1005 Metric), RoHS, Tape and Reel; Manufacturer: Basic Passives; Power Rating: 62.5 mW; Voltage Rating: 50 V; Case\/Package: 0402; Length: 1 mm; RoHSCompliant: true; Mounting Technology: Surface Mount; Min Operating Temperature: -55 degC; PackageDescription: 2-Pin Surface Mount Device, Body 1 x 0.5 mm; Case Code (Imperial): 0402; Resistance: 180 KOhm; ComponentLink2URL: http://download.siliconexpert.com/pdfs/2016/1/13/0/45/27/830/yageo_/manual/8727809758379137pyu-rc_group_51_rohs_l___3.pdf; Packaging: Tape and Reel; Tolerance: 1%; Width: 0.5 mm; PackageReference: 0402; PartNumber: RC0402FR-07180KL; Max Operating Temperature: 155 degC; Package Quantity: 200; Height: 0.35 mm; Mount: Surface Mount; Pins: 2; DatasheetVersion: 12/2015; ComponentLink1URL: http://www.yageo.com/; ComponentLink1Description: Manufacturer URL; Case Code (Metric): 1005; REACH SVHC: No SVHC; ComponentLink2Description: Datasheet
R60 R62-R65 = CMP-2002-05525-2: Thick Film Chip Resistors 0402 1MΩ 0.0625W 5% 200ppm/°C; Voltage Rating: 50V; Max Power Dissipation: 63mW; Resistance: 1MR; Power Rating: 62.5mW; Case/Package: 0402; Depth: 0.5mm; Case Code (Imperial): 0402; Width: 0.02inch; Length: 1mm; Tolerance: 5%; Min Operating Temperature: -55°C; Number of Terminations: 2; Thickness: 356um; Case Code (Metric): 1005; Radiation Hardening: No; Height: 0.016inch; Military Standard: Not; Mount: Surface Mount; Termination: SMD/SMT; Composition: Thick Film; Temperature Coefficient: 200ppm/°C; Contact Plating: Tin; Packaging: Tape and Reel; Package Quantity: 10000; Max Operating Temperature: 125°C
RTC1 = CMP-10083-000010-1: IC RTC CLK/CALENDAR I2C 8-SOIC; Manufacturer: NXP; Nominal Supply Current: 0.225-0.95uA; Interface: I2C,2-Wire; Min Supply Voltage: 1V; Frequency: 400kHz; Standoff Height: 0.1mm; Number Of Outputs: 1; Max Supply Voltage: 5.5V; Digikey Description: IC RTC CLK/CALENDAR I2C 8-SOIC; Height: 1.75mm; Temperature: -40°C to +85°C; Category: IC; Package: SOT96-1; Ambient Temperature Range High: +85°C; Octopart: https://octopart.com/pcf8563t%2F5%2C518-nxp+semiconductors-19647995; Footprint Url: https://www.nxp.com/docs/en/package-information/SOT96-1.pdf; ComponentLink2URL: https://www.nxp.com/docs/en/data-sheet/PCF8563.pdf; RoHS: TRUE; ComponentLink2Description: Datasheet; Lead Free: Yes; Temperature Range Low: -40°C; Ambient Temperature Range Low: -40°C; Manufacturer Part Number: PCF8563T/5,518; Device Class L3: Real Time Clocks; Temperature Range High: +85°C; Automotive: No; Device Class L2: Clock and Timing; Mouser Description: Real Time Clock Binary I2C 1-5V RTC IC; Device Class L1: Integrated Circuits (ICs)
U3 = CMP-2000-07467-2: IMU ACCEL/GYRO I2C/SPI 14LGA; Manufacturer: STMicroelectronics; Resolution: 16bits; Max Supply Voltage: 3.6V; Sensor Type: Temperature,Accelerometer,Gyroscope; Sensor Output: I2C,SPI; Gyro Range: 125/250/500/1000/2000°/s; Accel Range: 2/4/8/16g; Operating Supply Current: 0.29-0.65mA; Min Supply Voltage: 1.62V; Package: LGA-14L-DM00249496; Temperature Range High: +85°C; Automotive: No; Footprint Url: https://www.st.com/resource/en/technical_note/cd00134799.pdf; Height: 0.86mm; Device Class L1: Sensors; Octopart: https://octopart.com/lsm6dsltr-stmicroelectronics-66358193; Device Class L2: Motion Sensors; Lead Free: Yes; Category: IC; Device Class L3: Inertial Measurement Units (IMUs); ComponentLink2Description: Datasheet; RoHS: TRUE; ComponentLink2URL: https://www.st.com/resource/en/datasheet/lsm6dsl.pdf; Temperature Range Low: -40°C; Manufacturer Part Number: LSM6DSLTR; Mouser Description: iNEMO inertial module: always-on 3D accelerometer and 3D gyroscope; Digikey Description: IMU ACCEL/GYRO I2C/SPI 14LGA; Temperature: -40°C to +85°C

## Sheet 8_Airframe-Misc.SchDoc
size A4; SheetNumber: 8; SheetTotal: 9
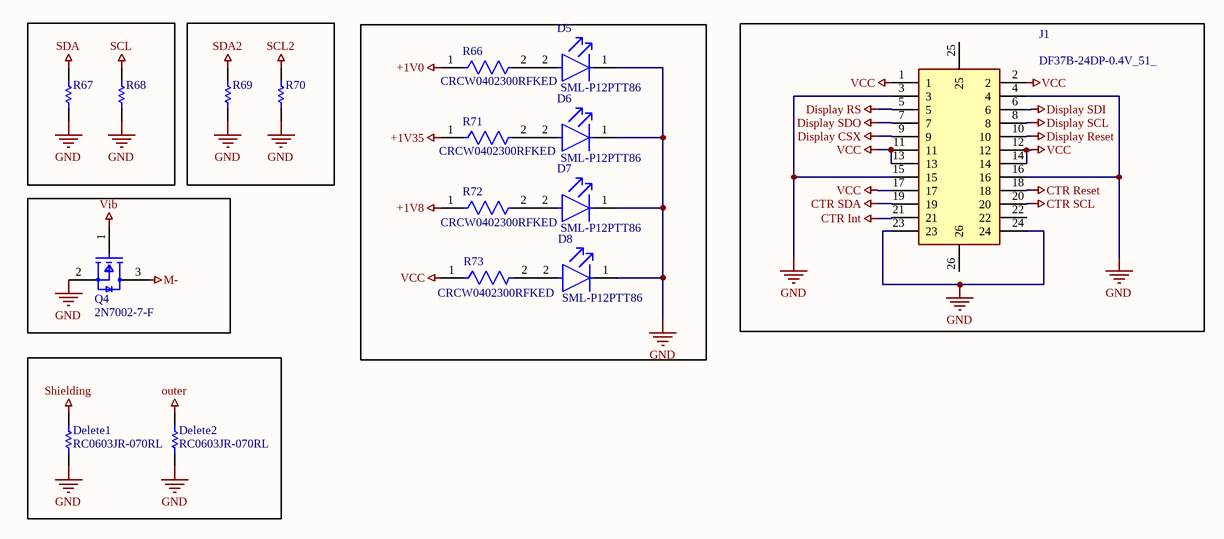
[diagram p8: 8_Airframe-Misc.SchDoc]

### Parts
D5  SML-P12PTT86  [FP-SML-P1-MFG]
D6  SML-P12PTT86  [FP-SML-P1-MFG]
D7  SML-P12PTT86  [FP-SML-P1-MFG]
D8  SML-P12PTT86  [FP-SML-P1-MFG]
Delete1  RC0603JR-070RL  [RESC1608X55X25ML10T15]
Delete2  RC0603JR-070RL  [RESC1608X55X25ML10T15]
J1  DF37B-24DP-0.4V_51_  [DF37B24DP04V51]
Q4  2N7002-7-F  [FP-SOT23-MFG]
R66  CRCW0402300RFKED  [FP-CRCW0402-e3-MFG]
R67  ERJ-2RKF4701X  [RESC1005X40X25ML05T05]  (value not drawn)
R68  ERJ-2RKF4701X  [RESC1005X40X25ML05T05]  (value not drawn)
R69  ERJ-2RKF4701X  [RESC1005X40X25ML05T05]  (value not drawn)
R70  ERJ-2RKF4701X  [RESC1005X40X25ML05T05]  (value not drawn)
R71  CRCW0402300RFKED  [FP-CRCW0402-e3-MFG]
R72  CRCW0402300RFKED  [FP-CRCW0402-e3-MFG]
R73  CRCW0402300RFKED  [FP-CRCW0402-e3-MFG]

### Nets
+1V0: R66.1
+1V8: R72.1
+1V35: R71.1
CTR Int: J1.21
CTR Reset: J1.18
CTR SCL: J1.20
CTR SDA: J1.19
Display CSX: J1.9
Display Reset: J1.10
Display RS: J1.5
Display SCL: J1.8
Display SDI: J1.6
Display SDO: J1.7
GND: D5.1(C) D6.1(C) D7.1(C) D8.1(C) Delete1.1 Delete2.1 J1.3 J1.4 J1.15 J1.16 J1.23 J1.24 Q4.2(S) R67.1 R68.1 R69.1 R70.1  [project net CTR]
M-: Q4.3(D)
outer: Delete2.2
SCL: R68.2
SCL2: R70.2
SDA: R67.2
SDA2: R69.2
Shielding: Delete1.2
VCC: J1.1 J1.2 J1.11 J1.12 J1.13 J1.14 J1.17 R73.1  [project net +VS]
Vib: Q4.1(G)
NetD5_2: D5.2(A) R66.2
NetD6_2: D6.2(A) R71.2
NetD7_2: D7.2(A) R72.2
NetD8_2: D8.2(A) R73.2

Not connected (* = marked no-connect by the designer): J1 22 25 26

### Library data of the parts
D5-D8 = CMP-08952-000020-1: LED GREEN CLEAR 1006 SMD; Manufacturer: Rohm; Led Orientation: Top View; Wavelength: 560nm; Forward Current: 20mA; Reverse Voltage: 5V; Power Dissipation: 52mW; Forward Voltage: 2.1V; Luminous Intensity: 10mcd; Device Class L1: Optoelectronics; Digikey Description: LED GREEN CLEAR 1006 SMD; Lead Free: Yes; Manufacturer Part Number: SML-P12PTT86; Temperature Range High: +85°C; Octopart: https://octopart.com/sml-p12ptt86-rohm-9290705; Device Class L2: LEDs; Colour: Green; RoHS: TRUE; Height: 0.25mm; Automotive: No; Device Class L3: unset; Temperature Range Low: -40°C; ComponentLink2Description: Datasheet; Mouser Description: Standard LEDs - SMD SMD Green 13 mcd height=0.2; Category: Diode; ComponentLink2URL: https://www.rohm.com/datasheet/SML-P12DT(R); Temperature: -40°C to +85°C; Package: SML-P1
Delete1 Delete2 = CMP-2100-03667-1: Chip Resistor, 0 Ohm, +/- 5%, 0.1 W, -55 to 155 degC, 0603 (1608 Metric), RoHS, Tape and Reel; Manufacturer: Yageo; Temperature Coefficient: 200ppm/degreesC; Voltage Rating: 50V; Power Rating: 100mW; Resistance: 0mOhm; Width: 0.8mm; Max Operating Temperature: 155degC; Tolerance: 5%; Package Reference: 0603; Height: 0.45mm; Depth: 0.8mm; Package Description: 2-Pin Surface Mount Device, Body 1.6 x 0.8 mm; Termination: SMD/SMT; Package Quantity: 5000; Case/Package: 0603; Case Code (Imperial): 0603; Radiation Hardening: No; Number of Pins: 2; Length: 1.6mm; Lead Free: LeadFree; Voltage Rating (DC): 50V; Military Standard: Not; Datasheet URL: http://www.yageo.com/NewPortal/yageodocoutput?fileName=/pdf/R-Chip/PYu-RC_Group_51_RoHS_L_5.pdf; Manufacturer URL: http://www.yageo.com/; Packaging: TapeandReel; Case Code (Metric): 1608; Min Operating Temperature: -55degC; Composition: ThickFilm; RoHSCompliant: true; Contact Plating: Tin; Datasheet Version: Rev. 5, 10/2016; REACH SVHC: NoSVHC
J1 = DF37B-24DP-0.4V_51_: Connector; Manufacturer_Name: Hirose; Manufacturer_Part_Number: DF37B-24DP-0.4V(51); Datasheet Link: https://www.hirose.com/product/download/?distributor=digikey&type=2d&lang=en&num=DF37B-24DP-0.4V(51); Mouser Part Number: 798-DF37B24DP04V51; Mouser Price/Stock: https://www.mouser.co.uk/ProductDetail/Hirose-Connector/DF37B-24DP-04V51?qs=eDUdFcBPps0B7iwhROz75A%3D%3D
Q4 = CMP-2000-04929-2: MOSFET N-CH 60V 115MA SOT23-3; Turn-On Delay Time: 7ns; Turn-Off Delay Time: 11ns; Drain to Source Resistance: 7.5R; Rise Time: 3ns; Drain to Source Breakdown Voltage: 70V; Input Capacitance: 50pF; Number of Elements: 1; Power Dissipation: 540mW; Max Power Dissipation: 300mW; Fall Time: 5.6ns; Gate to Source Voltage (Vgs): 20V; Threshold Voltage: 2.5V; Element Configuration: Single; Termination: SMD/SMT; Weight: 0.000282oz; Radiation Hardening: No; Max Operating Temperature: 150°C; On-State Resistance: 7.5R; Mount: Surface Mount; Current Rating: 115mA; Contact Plating: Tin; Lead Free: Lead Free; Min Operating Temperature: -55°C; Number of Pins: 3; REACH SVHC: No SVHC; Drain to Source Voltage (Vdss): 60V; Width: 1.3mm; Package Quantity: 3000; Length: 2.9mm; Case/Package: SOT-23; Number of Channels: 1; Dual Supply Voltage: 60V; Packaging: Tape and Reel; Height: 1mm; Voltage Rating (DC): 60V; Nominal Vgs: 2.5V; Continuous Drain Current (ID): 115mA; Voltage: 60V; Rds On Max: 7.5R
R66 R71-R73 = CMP-2002-08497-2: RES Thick Film, 300Ω, 1%, 0.063W, 100ppm/°C, 0402; Voltage Rating: 50V; Resistance: 300R; Max Power Dissipation: 63mW; Depth: 0.5mm; Tolerance: 1%; Package Quantity: 10; Temperature Coefficient: 100ppm/°C; Features: Automotive AEC-Q200; Military Standard: Not; Case Code (Metric): 1005; Voltage Rating (DC): 50V; Case/Package: 0402; Lead Free: Lead Free; Contact Plating: Tin; Min Operating Temperature: -55°C; Length: 1mm; Number of Terminations: 2; Case Code (Imperial): 0402; Weight: 2.3E-05oz; Mount: Surface Mount; Termination: SMD/SMT; Max Operating Temperature: 155°C; Width: 0.02inch; Composition: Thick Film; Height: 0.35mm; Power Rating: 63mW; Radiation Hardening: No; Packaging: Tape and Reel
R67-R70 = CMP-2002-01154-4: Chip Resistor, 4.7 KOhm, +/- 1%, 0.1 W, -55 to 155 degC, 0402 (1005 Metric), RoHS, Tape and Reel; Voltage Rating: 50 V; Case\/Package: 0402; Power Rating: 100 mW; Height: 0.35 mm; Mounting Technology: Surface Mount; REACH SVHC: Yes; Resistance: 4.7 KOhm; Max Operating Temperature: 155 degC; ComponentLink1Description: Manufacturer URL; ComponentLink2Description: Datasheet; Pins: 2; PackageReference: 0402; Tolerance: 1%; Case Code (Imperial): 0402; Length: 1 mm; PackageDescription: 2-Pin Surface Mount Device, Body 1 x 0.5 mm; PartNumber: ERJ-2RKF4701X; RoHSCompliant: true; Package Quantity: 1; Radiation Hardening: No; DatasheetVersion: 04/2015; Width: 0.5 mm; Case Code (Metric): 1005; Mount: Surface Mount; ComponentLink1URL: http://www.panasonic.com/; Min Operating Temperature: -55 degC; Packaging: Cut Tape; ComponentLink2URL: http://industrial.panasonic.com/cdbs/www-data/pdf/RDA0000/AOA0000C86.pdf

## Sheet 9_Airframe-Wireless.SchDoc
size A3; SheetNumber: 9; SheetTotal: 9
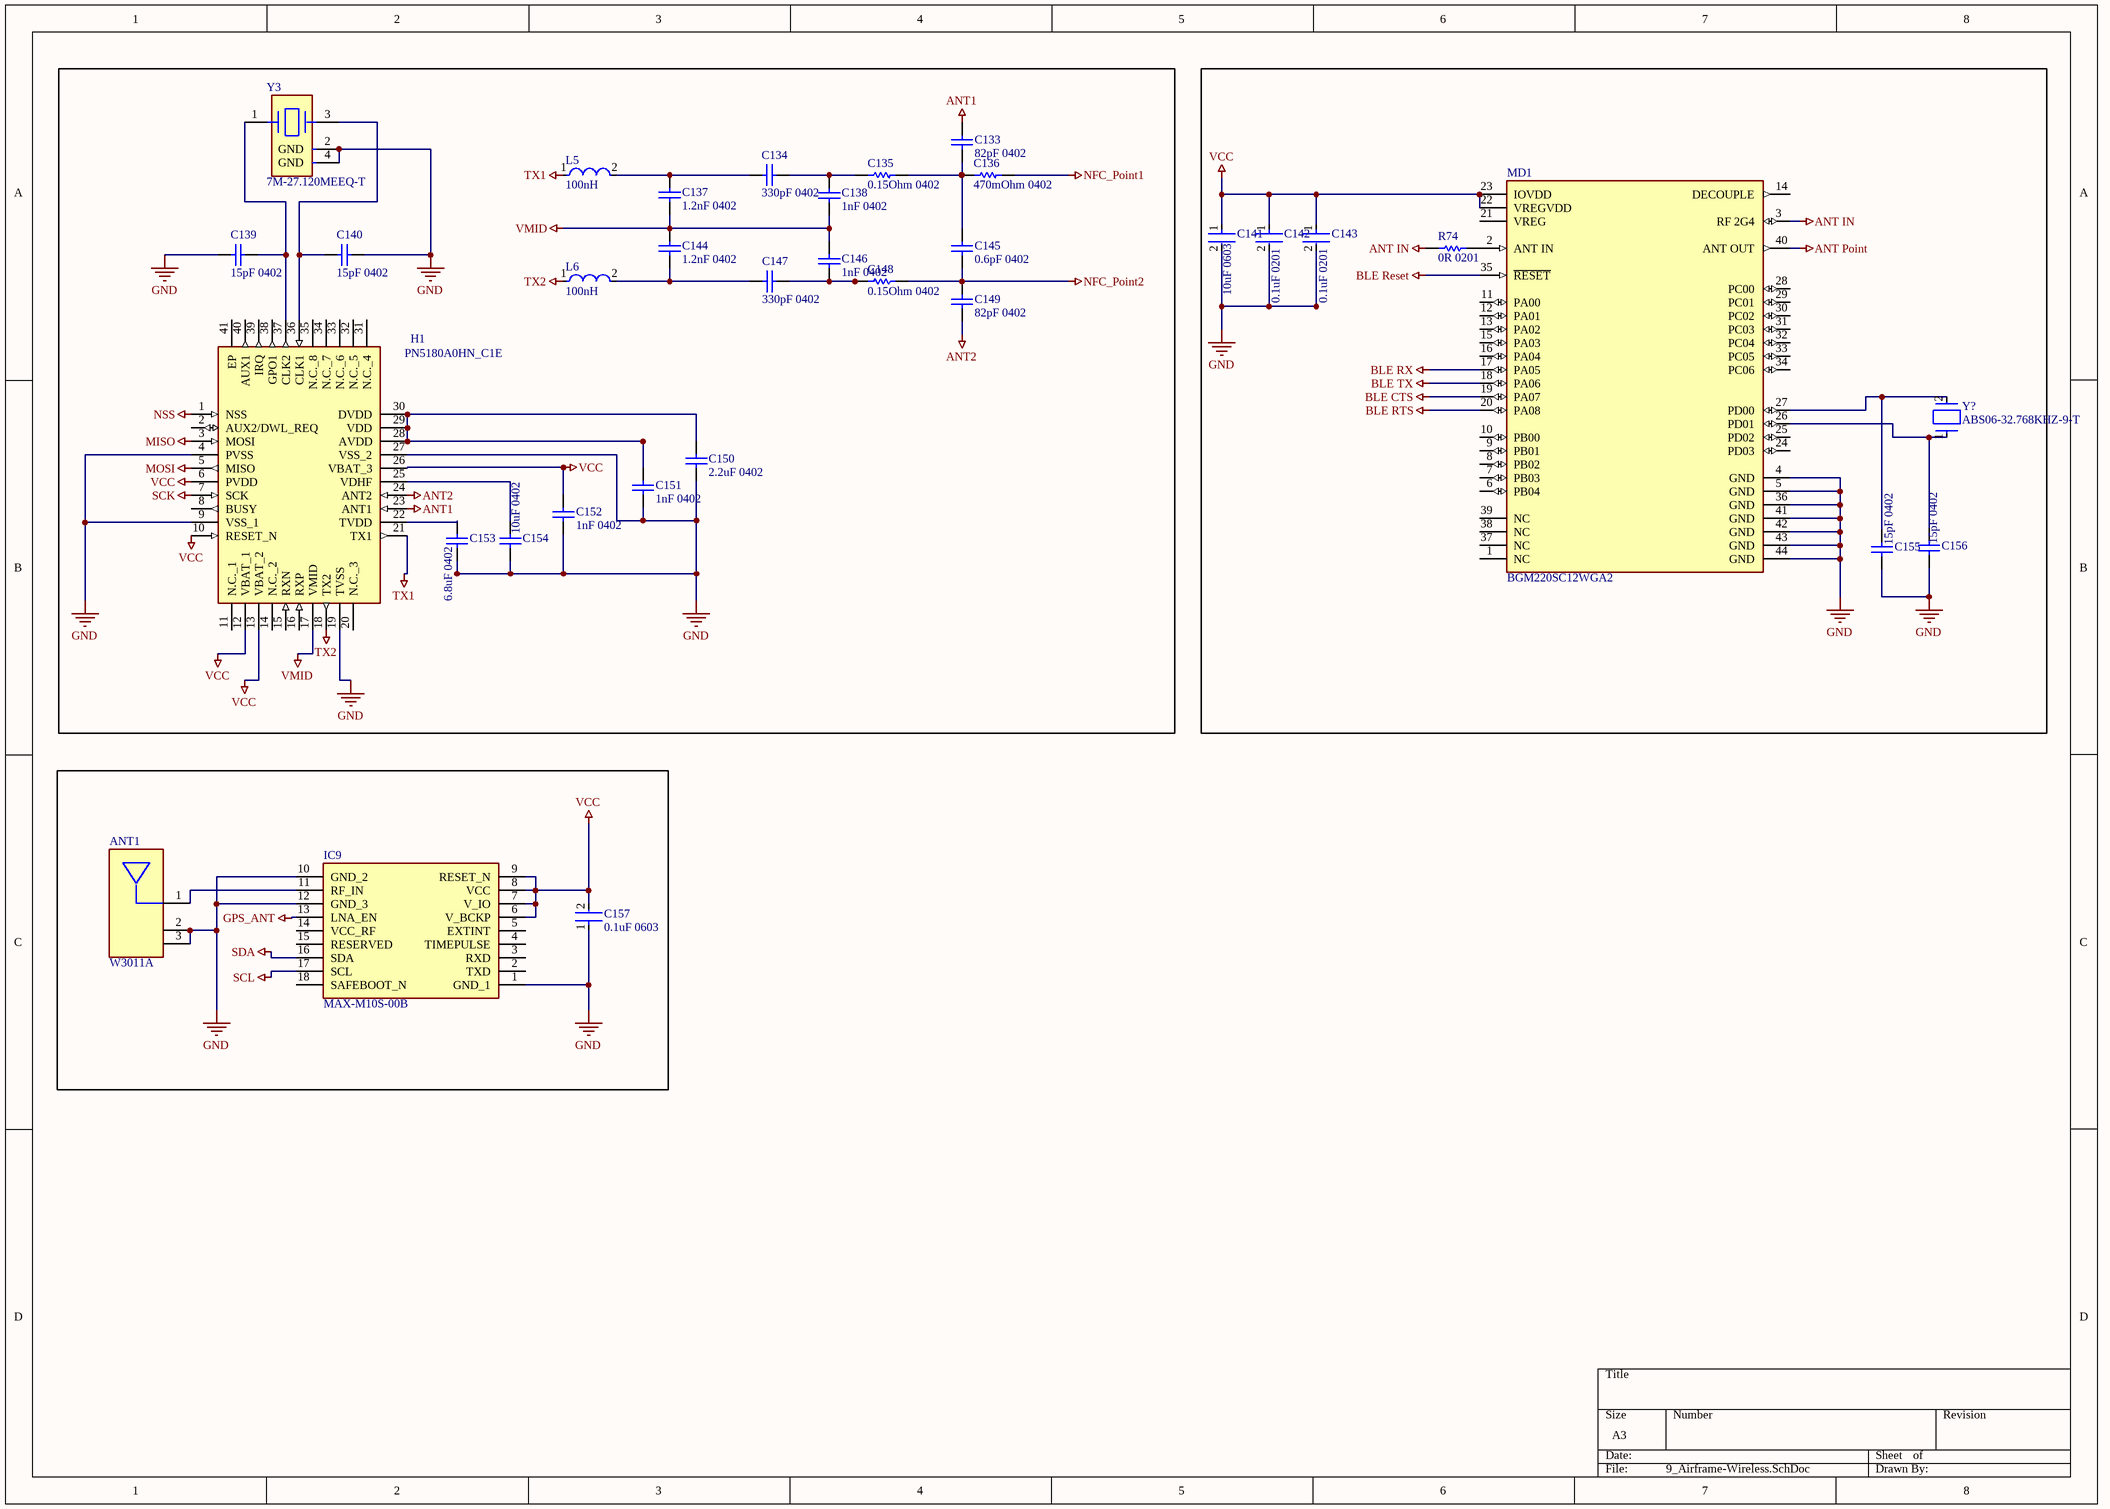
[diagram p9: 9_Airframe-Wireless.SchDoc]

### Parts
ANT1  W3011A  [FP-W3011A-MFG]
C133  82pF 0402  [CAPC1005X55X25ML5T10]
C134  330pF 0402  [CAPC1005X55X25ML5T10]
C135  0.15Ohm 0402  [RESC1608X55X25ML10T15]
C136  470mOhm 0402  [RESC1608X55X25ML10T15]
C137  1.2nF 0402  [CAPC1005X55X25ML5T10]
C138  1nF 0402  [CAPC1005X55X25ML5T10]
C139  15pF 0402  [CAPC1005X55X25ML5T10]
C140  15pF 0402  [CAPC1005X55X25ML5T10]
C141  10uF 0603  [FP-GRM188-0_2-IPC_C]
C142  0.1uF 0201  [FP-C0603-030-0_03-IPC_C]
C143  0.1uF 0201  [FP-C0603-030-0_03-IPC_C]
C144  1.2nF 0402  [CAPC1005X55X25ML5T10]
C145  0.6pF 0402  [CAPC1005X55X25ML5T10]
C146  1nF 0402  [CAPC1005X55X25ML5T10]
C147  330pF 0402  [CAPC1005X55X25ML5T10]
C148  0.15Ohm 0402  [RESC1608X55X25ML10T15]
C149  82pF 0402  [CAPC1005X55X25ML5T10]
C150  2.2uF 0402  [CAPC1005X55X25ML5T10]
C151  1nF 0402  [CAPC1005X55X25ML5T10]
C152  1nF 0402  [CAPC1005X55X25ML5T10]
C153  6.8uF 0402  [CAPC1005X55X25ML5T10]
C154  10uF 0402  [CAPC1005X55X25ML5T10]
C155  15pF 0402  [CAPC1005X55X25ML5T10]
C156  15pF 0402  [CAPC1005X55X25ML5T10]
C157  0.1uF 0603  [FP-C0603C-CF-MFG]
H1  PN5180A0HN_C1E  [QFN50P600X600X100-41N-D]
IC9  MAX-M10S-00B  [MAXM10S00B]
L5  100nH  [FP-LQM18NN_00-IPC_C]
L6  100nH  [FP-LQM18NN_00-IPC_C]
MD1  BGM220SC12WGA2  [FP-BGM220SC12WGA2-MFG]
R74  0R 0201  [RESC0603X28X15NL05T05]
Y3  7M-27.120MEEQ-T  [FP-7M-MFG]
Y?  ABS06-32.768KHZ-9-T  [FP-ABS06-MFG]

### Nets
ANT1: C133.1 H1.23(ANT1)
ANT2: C149.2 H1.24(ANT2)
ANT IN: MD1.3(RF_2G4) R74.2
ANT Point: MD1.40(ANT_OUT)
BLE CTS: MD1.19(PA07)
BLE Reset: MD1.35(~{RESET})
BLE RTS: MD1.20(PA08)
BLE RX: MD1.17(PA05)
BLE TX: MD1.18(PA06)
GND: ANT1.2(GND) ANT1.3(GND) C139.1 C140.2 C141.2 C142.2 C143.2 C150.2 C151.2 C152.2 C153.2 C154.2 C155.1 C156.1 C157.1 H1.4(PVSS) H1.9(VSS_1) H1.19(TVSS) H1.27(VSS_2) IC9.1(GND_1) IC9.10(GND_2) IC9.12(GND_3) MD1.4(GND) MD1.5(GND) MD1.36(GND) MD1.41(GND) MD1.42(GND) MD1.43(GND) MD1.44(GND) Y3.2(GND) Y3.4(GND)  [project net CTR]
GPS_ANT: IC9.13(LNA_EN)
MISO: H1.3(MOSI)
MOSI: H1.5(MISO)
NFC_Point1: C136.1
NFC_Point2: C145.2 C148.1 C149.1
NSS: H1.1(NSS)
SCK: H1.7(SCK)
SCL: IC9.17(SCL)
SDA: IC9.16(SDA)
TX1: H1.21(TX1) L5.1
TX2: H1.18(TX2) L6.1
VCC: C141.1 C142.1 C143.1 C152.1 C157.2 H1.6(PVDD) H1.10(RESET_N) H1.12(VBAT_1) H1.13(VBAT_2) H1.26(VBAT_3) IC9.6(V_BCKP) IC9.7(V_IO) IC9.8(VCC) IC9.9(RESET_N) MD1.22(VREGVDD) MD1.23(IOVDD)  [project net +VS]
VMID: C137.2 C138.1 C144.1 C146.2 H1.17(VMID)
NetANT1_1: ANT1.1(Feed) IC9.11(RF_IN)
NetC133_2: C133.2 C135.1 C136.2 C145.1
NetC134_1: C134.1 C137.1 L5.2
NetC134_2: C134.2 C135.2 C138.2
NetC139_2: C139.2 H1.37(CLK2) Y3.1
NetC140_1: C140.1 H1.36(CLK1) Y3.3
NetC144_2: C144.2 C147.1 L6.2
NetC146_1: C146.1 C147.2 C148.2
NetC150_1: C150.1 C151.1 H1.28(AVDD) H1.29(VDD) H1.30(DVDD)
NetC153_1: C153.1 H1.22(TVDD)
NetC154_1: C154.1 H1.25(VDHF)
NetC155_2: C155.2 MD1.27(PD00) Y?.2
NetC156_2: C156.2 MD1.26(PD01) Y?.1
NetMD1_2: MD1.2(ANT_IN) R74.1

Not connected (* = marked no-connect by the designer): H1 2(AUX2/DWL_REQ) 8(BUSY) 11(N.C._1) 14(N.C._2) 15(RXN) 16(RXP) 20(N.C._3) 31(N.C._4) 32(N.C._5) 33(N.C._6) 34(N.C._7) 35(N.C._8) 38(GPO1) 39(IRQ) 40(AUX1) 41(EP); IC9 2(TXD) 3(RXD) 4(TIMEPULSE) 5(EXTINT) 14(VCC_RF) 15(RESERVED) 18(SAFEBOOT_N); MD1 1(NC) 6(PB04) 7(PB03) 8(PB02) 9(PB01) 10(PB00) 11(PA00) 12(PA01) 13(PA02) 14(DECOUPLE) 15(PA03) 16(PA04) 21(VREG) 24(PD03) 25(PD02) 28(PC00) 29(PC01) 30(PC02) 31(PC03) 32(PC04) 33(PC05) 34(PC06) 37(NC) 38(NC) 39(NC)

### Library data of the parts
ANT1 = CMP-16379-000002-1: RF ANT 1.575GHZ CHIP SOLDER SMD; Manufacturer: PulseLarsen Antennas; Bandwidth: 1559-1606.6MHz; Number Of Bands: 1; Max Frequency: 1606.6MHz; Impedance: 50Ω; Return Loss: -6/-7/-10dB; Gain: 1.8dB; Power Rating: 2W; Octopart: https://octopart.com/w3011a-pulse-10684180; Temperature Range Low: -40°C; Temperature Range High: +85°C; Height: 1.3mm; ComponentLink2URL: https://www.pulseelectronics.com/docs/library/W3011.pdf; Device Class L2: RF Semiconductors and Devices; ComponentLink2Description: Datasheet; Automotive: No; Device Class L3: RF Antennas; RoHS: TRUE; Digikey Description: RF ANT 1.575GHZ CHIP SOLDER SMD; Package: W3011A; Lead Free: Yes; Manufacturer Part Number: W3011A; Temperature: -40°C to +85°C; Category: Ant; Device Class L1: Integrated Circuits (ICs)
C133 C134 C137 C139 C140 C144 C145 C147 C149 C150 C153-C156 = CMP-1662-00017-1: as C122 on sheet 7_Airframe-Sensors; Width: 0.5 mm; Pins: 2; REACH SVHC: No SVHC; Length: 1 mm; Height: 0.5 mm; PackageDescription: 2-Pin Surface Mount Device, Body 1 x 0.5 mm; DatasheetVersion: 07/2016; Mount: Surface Mount; ComponentLink2Description: Datasheet; Tolerance: 10%; ComponentLink2URL: http://psearch.en.murata.com/capacitor/product/GRM155R71H102KA01%23.pdf; ComponentLink1URL: http://www.murata.com/; Case Code (Metric): 1005; Package Quantity: 10000; Min Operating Temperature: -55 degC; Max Operating Temperature: 125 degC; Voltage Rating: 50 V; ComponentLink1Description: Manufacturer URL; Packaging: Tape and Reel; Radiation Hardening: No; RoHSCompliant: true; PackageReference: 0402; Mounting Technology: Surface Mount; Case Code (Imperial): 0402
C135 C136 C148 = CMP-2100-03667-1: as Delete1 on sheet 8_Airframe-Misc; Width: 0.8mm; Max Operating Temperature: 155degC; Tolerance: 5%; Package Reference: 0603; Height: 0.45mm; Depth: 0.8mm; Package Description: 2-Pin Surface Mount Device, Body 1.6 x 0.8 mm; Termination: SMD/SMT; Package Quantity: 5000; Case/Package: 0603; Case Code (Imperial): 0603; Radiation Hardening: No; Number of Pins: 2; Length: 1.6mm; Lead Free: LeadFree; Voltage Rating (DC): 50V; Military Standard: Not; Datasheet URL: http://www.yageo.com/NewPortal/yageodocoutput?fileName=/pdf/R-Chip/PYu-RC_Group_51_RoHS_L_5.pdf; Manufacturer URL: http://www.yageo.com/; Packaging: TapeandReel; Case Code (Metric): 1608; Min Operating Temperature: -55degC; Composition: ThickFilm; RoHSCompliant: true; Contact Plating: Tin; Datasheet Version: Rev. 5, 10/2016; REACH SVHC: NoSVHC
C138 C146 C151 C152 = CMP-1662-00017-1: Chip Capacitor, 1 nF, +/- 10%, 50 V, -55 to 125 degC, 0402 (1005 Metric), RoHS, Tape and Reel; Case\/Package: 0402; Type (Capacitors): X7R; Voltage Rating (DC): 50 V; Width: 0.5 mm; Pins: 2; REACH SVHC: No SVHC; Length: 1 mm; Height: 0.5 mm; PackageDescription: 2-Pin Surface Mount Device, Body 1 x 0.5 mm; DatasheetVersion: 07/2016; Mount: Surface Mount; ComponentLink2Description: Datasheet; Tolerance: 10%; ComponentLink2URL: http://psearch.en.murata.com/capacitor/product/GRM155R71H102KA01%23.pdf; ComponentLink1URL: http://www.murata.com/; Case Code (Metric): 1005; Package Quantity: 10000; Min Operating Temperature: -55 degC; Max Operating Temperature: 125 degC; Capacitance: 1 nF; Voltage Rating: 50 V; ComponentLink1Description: Manufacturer URL; Packaging: Tape and Reel; Radiation Hardening: No; RoHSCompliant: true; PackageReference: 0402; Mounting Technology: Surface Mount; Case Code (Imperial): 0402
C141 = CMP-2000-06337-3: as C124 on sheet 7_Airframe-Sensors; Tolerance: 20%; Weight: 0.000222oz; Material: Ceramic; Depth: 0.8mm; Length: 1.6mm; Termination: SMD/SMT; Capacitance: 22uF; Packaging: Tape and Reel; Width: 0.8mm; Voltage Rating: 10V; Case Code (Imperial): 0603; Mount: Surface Mount; Voltage Rating (DC): 10V; Case/Package: 0603; Thickness: 0.039inch; REACH SVHC: No SVHC; Dielectric: X5R; Height: 0.8mm; Package Quantity: 4000; Case Code (Metric): 1608; Min Operating Temperature: -55°C; Lead Free: Lead Free; Max Operating Temperature: 85°C
C142 C143 = CMP-08246-007095-1: as C120 on sheet 6_Airframe-NXP_i.MX7; Dielectric: X6S; Resistor Type: Ceramic; Length: 0.6mm; Capacitance: 220nF; Case Code (Metric): 0603; Series: C; Width: 0.012inch; Height: 0.3mm; Voltage Rating: 6.3V; Max Operating Temperature: 105°C; REACH SVHC: No SVHC; RoHS Compliant: Yes; Tolerance: 10%; Termination: SMD/SMT; Case/Package: 0201; Case Code (Imperial): 0201; Weight: 6E-06oz; Lead Free: Lead Free; Construction: Flat; Thickness: 300um; Mount: Surface Mount; Dielectric Material: Ceramic; Voltage Rating (DC): 6.3V; Packaging: Cut Tape; Package Quantity: 1; Min Operating Temperature: -55°C; Depth: 0.3mm
C157 = CMP-2006-03061-2: CAP CER 0.1UF 50V X7R 0603; Manufacturer: KEMET; Manufacturer Part Number: C0603C104K5RACTU; Tolerance: 0.1; Temperature Coefficient: 30ppm/°C; Material: Ceramic; Automotive Grade: Grade 1; Value: 0.10 μF; Temperature: -55°C to +125°C; RoHS: TRUE; Temperature Range High: +125°C; Lead Free: Yes; Octopart: https://octopart.com/c0603c104k5ractu-kemet-139244; Digikey Description: CAP CER 0.1UF 50V X7R 0603; Category: Cap; Package: C0603C-CF; ComponentLink2Description: Datasheet; Temperature Range Low: -55°C; Device Class L1: Passive Components; Voltage Rating: 50 V; Automotive: Yes; Device Class L3: Ceramic Capacitors; ComponentLink2URL: https://api.kemet.com/component-edge/download/datasheet/C0603C100J5GACAUTO.pdf; Capacitance: 0.10 μF; Device Class L2: Capacitors; Temperature Characteristic: X7R; Height: 0.87mm
H1 = PN5180A0HN_C1E: Hardware; Manufacturer_Name: NXP; Manufacturer_Part_Number: PN5180A0HN/C1E; Datasheet Link: https://datasheet.datasheetarchive.com/originals/distributors/DKDS42/DSANUWW0047957.pdf; Height: 1mm; Mouser Part Number: 771-PN5180A0HN/C1E; Mouser Price/Stock: https://www.mouser.co.uk/ProductDetail/NXP-Semiconductors/PN5180A0HN-C1E?qs=ycOx5YLpuFVFXy2iTiMBHA%3D%3D; Arrow Part Number: PN5180A0HN/C1E; Arrow Price/Stock: https://www.arrow.com/en/products/pn5180a0hnc1e/nxp-semiconductors?region=nac
IC9 = MAX-M10S-00B: Integrated Circuit; Manufacturer_Name: U-Blox; Datasheet Link: https://content.u-blox.com/sites/default/files/MAX-M10S_IntegrationManual_UBX-20053088.pdf; Height: 2.7mm; Manufacturer_Part_Number: MAX-M10S-00B; Mouser Part Number: 377-MAX-M10S-00B; Mouser Price/Stock: https://www.mouser.co.uk/ProductDetail/u-blox/MAX-M10S-00B?qs=A6eO%252BMLsxmT0PfQYPb7LLQ%3D%3D
L5 L6 = CMP-06042-014173-1: Multilayer Type Inductor for General Circuits, 0603 (1608), 100nH, 10%, 0.5Ω, 50mA; Shielding: Shielded; Self Resonant Frequency: 240MHz; Core Material: Ferrite; Resistance: 500mR; Q Factor: 15; Test Frequency: 25MHz; Height - Seated (Max): 0.035inch; Termination: SMD/SMT; Tolerance: 10%; Depth: 0.95mm; Current Rating: 50mA; Packaging: Tape and Reel; Military Standard: Not; REACH SVHC: No SVHC; Max Operating Temperature: 85°C; Radiation Hardening: No; Length: 1.6mm; Inductance Tolerance: 10%; Inductance: 100nH; Case Code (Imperial): 0603; Min Operating Temperature: -40°C; Number of Pins: 2; DC Resistance (DCR): 500mR; Width: 0.031inch; Height: 0.8mm; Max DC Current: 50mA; Case/Package: 0603; Package Quantity: 4000; Mount: Surface Mount; Lead Free: Lead Free; DC Current: 50mA; Case Code (Metric): 1608
MD1 = CMP-08140-000024-1: WIRELESS GECKO, BLUETOOTH SIP MO
R74 = CMP-2004-00006-1: Manufacturer: Vishay; Part Number: CRCW0201100RFNED
Y3 = CMP-2000-05695-2: Crystal 27.12MHz, 10ppm, 10pF, 50Ω; ESR (Equivalent Series Resistance): 60R; Termination: SMD/SMT; Min Operating Temperature: -10°C; Height: 0.031inch; Case/Package: SMD/SMT; Package Quantity: 3000; Width: 2.5mm; Max Operating Temperature: 70°C; Mount: Surface Mount; Series: 7M; Depth: 2.5mm; REACH SVHC: No SVHC; Packaging: Tape and Reel; Frequency Tolerance: 10ppm; Tolerance: 10ppm; Frequency: 27.12MHz; Load Capacitance: 10pF; Lead Free: Lead Free; Frequency Stability: 10ppm; Length: 3.2mm
Y? = CMP-27762-015421-1: as Y2 on sheet 6_Airframe-NXP_i.MX7; Max Operating Temperature: 85°C; Frequency Tolerance: 20ppm; Case/Package: CSMD; Termination: SMD/SMT; RoHS Compliant: Yes; Height: 0.6mm; Load Capacitance: 9pF; Packaging: Tape and Reel; Depth: 1.2mm; Tolerance: 20ppm; Frequency: 32.768kHz; Series: ABS06; Width: 1.2mm; Length: 2mm; Number of Pins: 2; Min Operating Temperature: -40°C; Mount: Surface Mount; Lead Free: Lead Free; Package Quantity: 3000